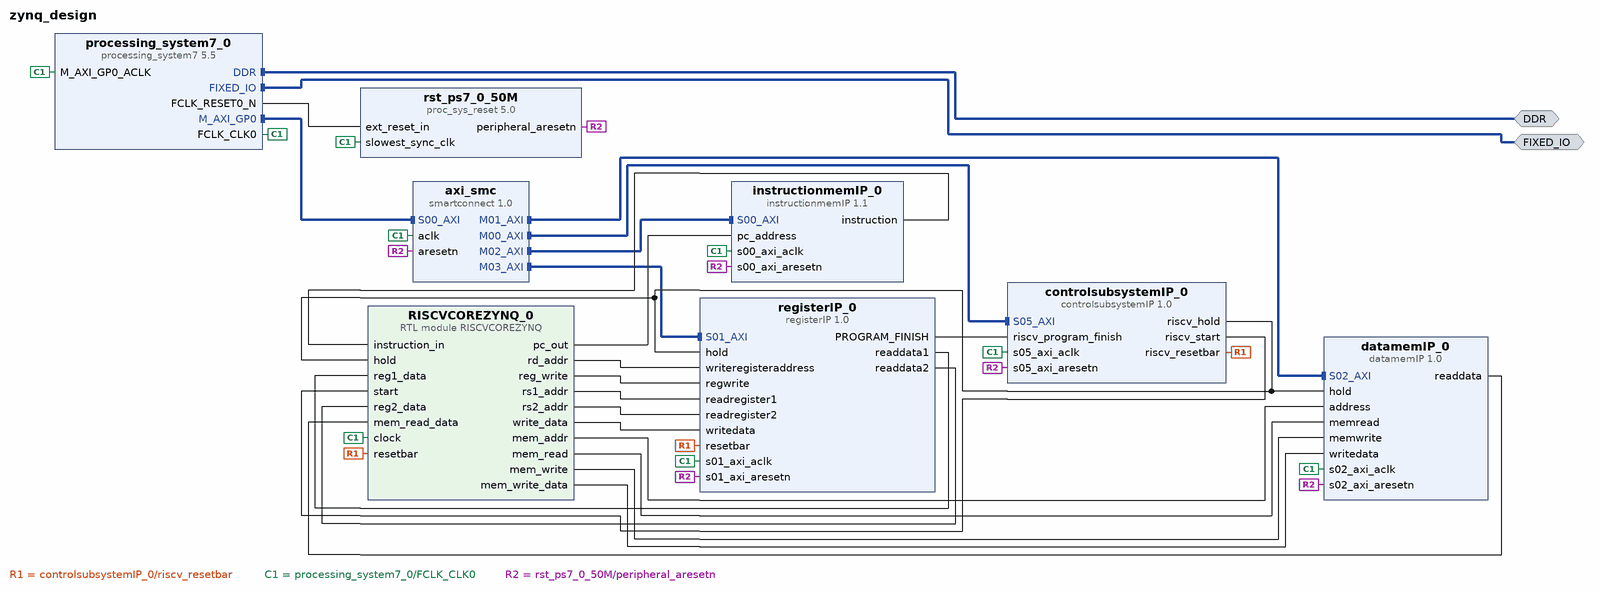
[diagram p0: block diagram of the top level]
# Vivado block design zynq_design, xc7z007sclg225-1, Vivado 2024.2
create_bd_design zynq_design

create_bd_intf_port -mode Master -vlnv xilinx.com:interface:ddrx_rtl:1.0 DDR
create_bd_intf_port -mode Master -vlnv xilinx.com:display_processing_system7:fixedio_rtl:1.0 FIXED_IO

create_bd_cell -type module -reference RISCVCOREZYNQ RISCVCOREZYNQ_0
create_bd_cell -type ip -vlnv xilinx.com:user:instructionmemIP:1.1 instructionmemIP_0
create_bd_cell -type ip -vlnv xilinx.com:user:datamemIP:1.0 datamemIP_0
create_bd_cell -type ip -vlnv xilinx.com:ip:processing_system7:5.5 processing_system7_0
set_property -dict [list \
  CONFIG.PCW_APU_PERIPHERAL_FREQMHZ 666.666666 \
  CONFIG.PCW_DM_WIDTH 2 \
  CONFIG.PCW_DQS_WIDTH 2 \
  CONFIG.PCW_DQ_WIDTH 16 \
  CONFIG.PCW_ENET0_PERIPHERAL_ENABLE 0 \
  CONFIG.PCW_FPGA0_PERIPHERAL_FREQMHZ 10 \
  CONFIG.PCW_FPGA1_PERIPHERAL_FREQMHZ 100 \
  CONFIG.PCW_GPIO_EMIO_GPIO_ENABLE 1 \
  CONFIG.PCW_GPIO_EMIO_GPIO_IO 16 \
  CONFIG.PCW_GPIO_EMIO_GPIO_WIDTH 16 \
  CONFIG.PCW_GPIO_MIO_GPIO_ENABLE 1 \
  CONFIG.PCW_GPIO_MIO_GPIO_IO MIO \
  CONFIG.PCW_I2C0_I2C0_IO EMIO \
  CONFIG.PCW_I2C0_PERIPHERAL_ENABLE 1 \
  CONFIG.PCW_I2C_PERIPHERAL_FREQMHZ 111.111115 \
  CONFIG.PCW_I2C_RESET_ENABLE 1 \
  CONFIG.PCW_I2C_RESET_SELECT {Share reset pin} \
  CONFIG.PCW_MIO_PRIMITIVE 32 \
  CONFIG.PCW_PRESET_BANK1_VOLTAGE {LVCMOS 3.3V} \
  CONFIG.PCW_QSPI_GRP_FBCLK_ENABLE 1 \
  CONFIG.PCW_QSPI_GRP_FBCLK_IO {MIO 8} \
  CONFIG.PCW_QSPI_GRP_SINGLE_SS_ENABLE 1 \
  CONFIG.PCW_QSPI_GRP_SINGLE_SS_IO {MIO 1 .. 6} \
  CONFIG.PCW_QSPI_PERIPHERAL_ENABLE 1 \
  CONFIG.PCW_QSPI_QSPI_IO {MIO 1 .. 6} \
  CONFIG.PCW_SD0_PERIPHERAL_ENABLE 1 \
  CONFIG.PCW_SD0_SD0_IO EMIO \
  CONFIG.PCW_SD1_PERIPHERAL_ENABLE 1 \
  CONFIG.PCW_SD1_SD1_IO {MIO 10 .. 15} \
  CONFIG.PCW_SDIO_PERIPHERAL_FREQMHZ 25 \
  CONFIG.PCW_SINGLE_QSPI_DATA_MODE x4 \
  CONFIG.PCW_UART0_GRP_FULL_ENABLE 1 \
  CONFIG.PCW_UART0_GRP_FULL_IO EMIO \
  CONFIG.PCW_UART0_PERIPHERAL_ENABLE 1 \
  CONFIG.PCW_UART0_UART0_IO EMIO \
  CONFIG.PCW_UART1_PERIPHERAL_ENABLE 1 \
  CONFIG.PCW_UART1_UART1_IO {MIO 48 .. 49} \
  CONFIG.PCW_UART_PERIPHERAL_FREQMHZ 100 \
  CONFIG.PCW_UIPARAM_DDR_BUS_WIDTH {16 Bit} \
  CONFIG.PCW_UIPARAM_DDR_FREQ_MHZ 533.333333 \
  CONFIG.PCW_UIPARAM_DDR_MEMORY_TYPE {DDR 3 (Low Voltage)} \
  CONFIG.PCW_UIPARAM_DDR_PARTNO {MT41K256M16 RE-125} \
  CONFIG.PCW_USB0_PERIPHERAL_ENABLE 1 \
  CONFIG.PCW_USB0_RESET_ENABLE 1 \
  CONFIG.PCW_USB0_RESET_IO {MIO 7} \
  CONFIG.PCW_USB0_USB0_IO {MIO 28 .. 39} \
  CONFIG.PCW_USB_RESET_ENABLE 1 \
  CONFIG.PCW_USB_RESET_SELECT {Share reset pin} \
] [get_bd_cells processing_system7_0]
# 319 more settings of processing_system7_0 are not shown: defaults, MIO pin electricals, DDR timing, and values the tool derives
create_bd_cell -type ip -vlnv xilinx.com:user:controlsubsystemIP:1.0 controlsubsystemIP_0
create_bd_cell -type ip -vlnv xilinx.com:ip:proc_sys_reset:5.0 rst_ps7_0_50M
create_bd_cell -type ip -vlnv xilinx.com:ip:smartconnect:1.0 axi_smc
set_property -dict {CONFIG.NUM_MI 4 CONFIG.NUM_SI 1} [get_bd_cells axi_smc]
create_bd_cell -type ip -vlnv xilinx.com:user:registerIP:1.0 registerIP_0

# ---- connections ----

connect_bd_intf_net [get_bd_intf_pins axi_smc/M00_AXI] [get_bd_intf_pins controlsubsystemIP_0/S05_AXI]
connect_bd_intf_net [get_bd_intf_pins axi_smc/M01_AXI] [get_bd_intf_pins datamemIP_0/S02_AXI]
connect_bd_intf_net [get_bd_intf_pins axi_smc/M02_AXI] [get_bd_intf_pins instructionmemIP_0/S00_AXI]
connect_bd_intf_net [get_bd_intf_pins axi_smc/M03_AXI] [get_bd_intf_pins registerIP_0/S01_AXI]
connect_bd_intf_net [get_bd_intf_ports DDR] [get_bd_intf_pins processing_system7_0/DDR]
connect_bd_intf_net [get_bd_intf_ports FIXED_IO] [get_bd_intf_pins processing_system7_0/FIXED_IO]
connect_bd_intf_net [get_bd_intf_pins processing_system7_0/M_AXI_GP0] [get_bd_intf_pins axi_smc/S00_AXI]
connect_bd_net [get_bd_pins RISCVCOREZYNQ_0/mem_addr] [get_bd_pins datamemIP_0/address]
connect_bd_net [get_bd_pins RISCVCOREZYNQ_0/mem_read] [get_bd_pins datamemIP_0/memread]
connect_bd_net [get_bd_pins RISCVCOREZYNQ_0/mem_write] [get_bd_pins datamemIP_0/memwrite]
connect_bd_net [get_bd_pins RISCVCOREZYNQ_0/mem_write_data] [get_bd_pins datamemIP_0/writedata]
connect_bd_net [get_bd_pins RISCVCOREZYNQ_0/pc_out] [get_bd_pins instructionmemIP_0/pc_address]
connect_bd_net [get_bd_pins RISCVCOREZYNQ_0/rd_addr] [get_bd_pins registerIP_0/writeregisteraddress]
connect_bd_net [get_bd_pins RISCVCOREZYNQ_0/reg_write] [get_bd_pins registerIP_0/regwrite]
connect_bd_net [get_bd_pins RISCVCOREZYNQ_0/rs1_addr] [get_bd_pins registerIP_0/readregister1]
connect_bd_net [get_bd_pins RISCVCOREZYNQ_0/rs2_addr] [get_bd_pins registerIP_0/readregister2]
connect_bd_net [get_bd_pins RISCVCOREZYNQ_0/write_data] [get_bd_pins registerIP_0/writedata]
connect_bd_net -net controlsubsystemIP_0_riscv_hold_enable [get_bd_pins controlsubsystemIP_0/riscv_hold] \
  [get_bd_pins RISCVCOREZYNQ_0/hold] [get_bd_pins datamemIP_0/hold] [get_bd_pins registerIP_0/hold]
connect_bd_net [get_bd_pins controlsubsystemIP_0/riscv_resetbar] [get_bd_pins RISCVCOREZYNQ_0/resetbar] [get_bd_pins registerIP_0/resetbar]
connect_bd_net [get_bd_pins controlsubsystemIP_0/riscv_start] [get_bd_pins RISCVCOREZYNQ_0/start]
connect_bd_net [get_bd_pins datamemIP_0/readdata] [get_bd_pins RISCVCOREZYNQ_0/mem_read_data]
connect_bd_net [get_bd_pins instructionmemIP_0/instruction] [get_bd_pins RISCVCOREZYNQ_0/instruction_in]
connect_bd_net [get_bd_pins processing_system7_0/FCLK_CLK0] \
  [get_bd_pins processing_system7_0/M_AXI_GP0_ACLK] [get_bd_pins rst_ps7_0_50M/slowest_sync_clk] [get_bd_pins axi_smc/aclk] \
  [get_bd_pins RISCVCOREZYNQ_0/clock] [get_bd_pins instructionmemIP_0/s00_axi_aclk] [get_bd_pins datamemIP_0/s02_axi_aclk] \
  [get_bd_pins controlsubsystemIP_0/s05_axi_aclk] [get_bd_pins registerIP_0/s01_axi_aclk]
connect_bd_net [get_bd_pins processing_system7_0/FCLK_RESET0_N] [get_bd_pins rst_ps7_0_50M/ext_reset_in]
connect_bd_net [get_bd_pins registerIP_0/PROGRAM_FINISH] [get_bd_pins controlsubsystemIP_0/riscv_program_finish]
connect_bd_net [get_bd_pins registerIP_0/readdata1] [get_bd_pins RISCVCOREZYNQ_0/reg1_data]
connect_bd_net [get_bd_pins registerIP_0/readdata2] [get_bd_pins RISCVCOREZYNQ_0/reg2_data]
connect_bd_net [get_bd_pins rst_ps7_0_50M/peripheral_aresetn] \
  [get_bd_pins axi_smc/aresetn] [get_bd_pins instructionmemIP_0/s00_axi_aresetn] [get_bd_pins datamemIP_0/s02_axi_aresetn] \
  [get_bd_pins controlsubsystemIP_0/s05_axi_aresetn] [get_bd_pins registerIP_0/s01_axi_aresetn]

# ---- address map ----
assign_bd_address -offset 0x43C00000 -range 64K -target_address_space [get_bd_addr_spaces processing_system7_0/Data] [get_bd_addr_segs controlsubsystemIP_0/S05_AXI/S05_AXI_reg]
assign_bd_address -offset 0x43C10000 -range 64K -target_address_space [get_bd_addr_spaces processing_system7_0/Data] [get_bd_addr_segs datamemIP_0/S02_AXI/S02_AXI_reg]
assign_bd_address -offset 0x43C20000 -range 64K -target_address_space [get_bd_addr_spaces processing_system7_0/Data] [get_bd_addr_segs instructionmemIP_0/S00_AXI/S00_AXI_reg]
assign_bd_address -offset 0x43C30000 -range 64K -target_address_space [get_bd_addr_spaces processing_system7_0/Data] [get_bd_addr_segs registerIP_0/S01_AXI/S01_AXI_reg]

validate_bd_design
save_bd_design
